# EAGLE schematic Output (EAGLE 7.3.0)
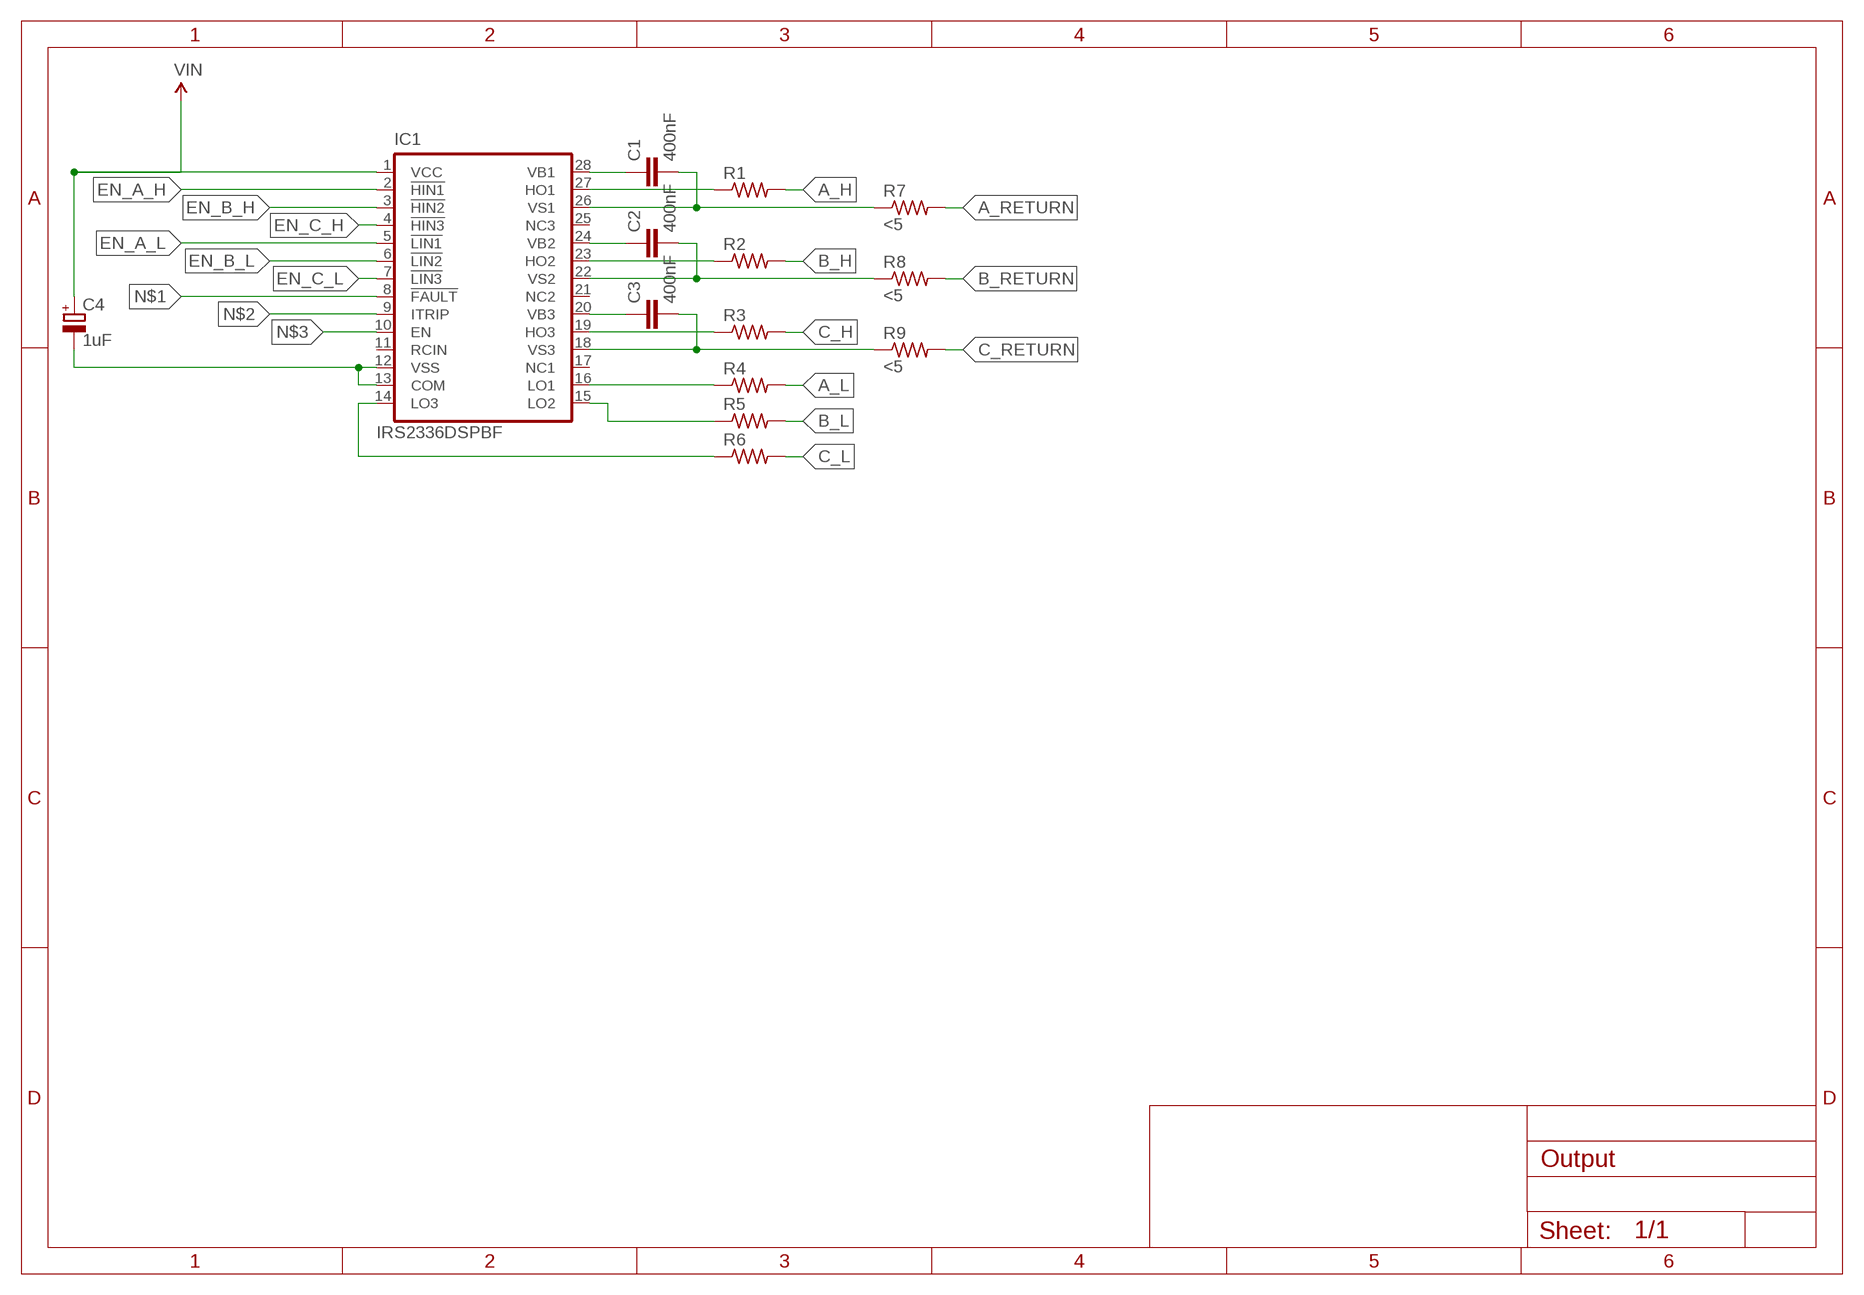
[diagram p0: schematic, sheet 1]

## Parts
C1  400nF  C-EU050-050X075  [C050-050X075]
C2  400nF  C-EU050-050X075  [C050-050X075]
C3  400nF  C-EU050-050X075  [C050-050X075]
C4  1uF  CPOL-EUE2-5  [E2-5]
IC1  IRS2336DSPBF  [SOICW28]
R1  R-US_0207/7  [0207/7]
R2  R-US_0207/7  [0207/7]
R3  R-US_0207/7  [0207/7]
R4  R-US_0207/7  [0207/7]
R5  R-US_0207/7  [0207/7]
R6  R-US_0207/7  [0207/7]
R7  <5  R-US_0207/7  [0207/7]
R8  <5  R-US_0207/7  [0207/7]
R9  <5  R-US_0207/7  [0207/7]

## Nets
8V: C4.+ IC1.1(VCC) ; supply symbol labelled VIN
A_H: R1.2
A_L: R4.2
A_RETURN: R7.2
B_H: R2.2
B_L: R5.2
B_RETURN: R8.2
C_H: R3.2
C_L: R6.2
C_RETURN: R9.2
EN_A_H: IC1.2(!HIN1)
EN_A_L: IC1.5(!LIN1)
EN_B_H: IC1.3(!HIN2)
EN_B_L: IC1.6(!LIN2)
EN_C_H: IC1.4(!HIN3)
EN_C_L: IC1.7(!LIN3)
N$1: IC1.8(!FAULT)
N$2: IC1.9(ITRIP)
N$3: IC1.10(EN)
N$4: C1.1 IC1.28(VB1)
N$6: C2.1 IC1.24(VB2)
N$7: IC1.14(LO3) R6.1
N$8: C3.1 IC1.20(VB3)
N$9: IC1.16(LO1) R4.1
N$10: IC1.15(LO2) R5.1
N$11: IC1.27(HO1) R1.1
N$12: IC1.23(HO2) R2.1
N$13: IC1.19(HO3) R3.1
N$14: C1.2 IC1.26(VS1) R7.1
N$15: C3.2 IC1.18(VS3) R9.1
N$16: C2.2 IC1.22(VS2) R8.1
V-: C4.- IC1.12(VSS) IC1.13(COM)
Unconnected: IC1.11(RCIN) IC1.17(NC1) IC1.21(NC2) IC1.25(NC3)

## Library data of the parts
C1-C3 = rcl:C-EU: CAPACITOR, European symbol
C4 = rcl:CPOL-EU: POLARIZED CAPACITOR, European symbol
IC1 = neeki-infineon:IRS2336DSPBF: HV 3 Phase Gate Driver Source: http://www.mouser.com/ds/2/196/irs2336-936863.pdf
R1-R9 = rcl:R-US_: RESISTOR, American symbol